# EasyEDA Pro project ProProject_OV-Tracker_V1.0_2024-05-14.epro

# Schematic Schematic1
Create Date: 2024-03-17; Page Name: P1; Project Name: OV-Tracker_V1.0; Schematic Name: Schematic1; Update Date: 2024-03-31; Company: 嘉立创EDA; Page Size: A4; Version: V1.0
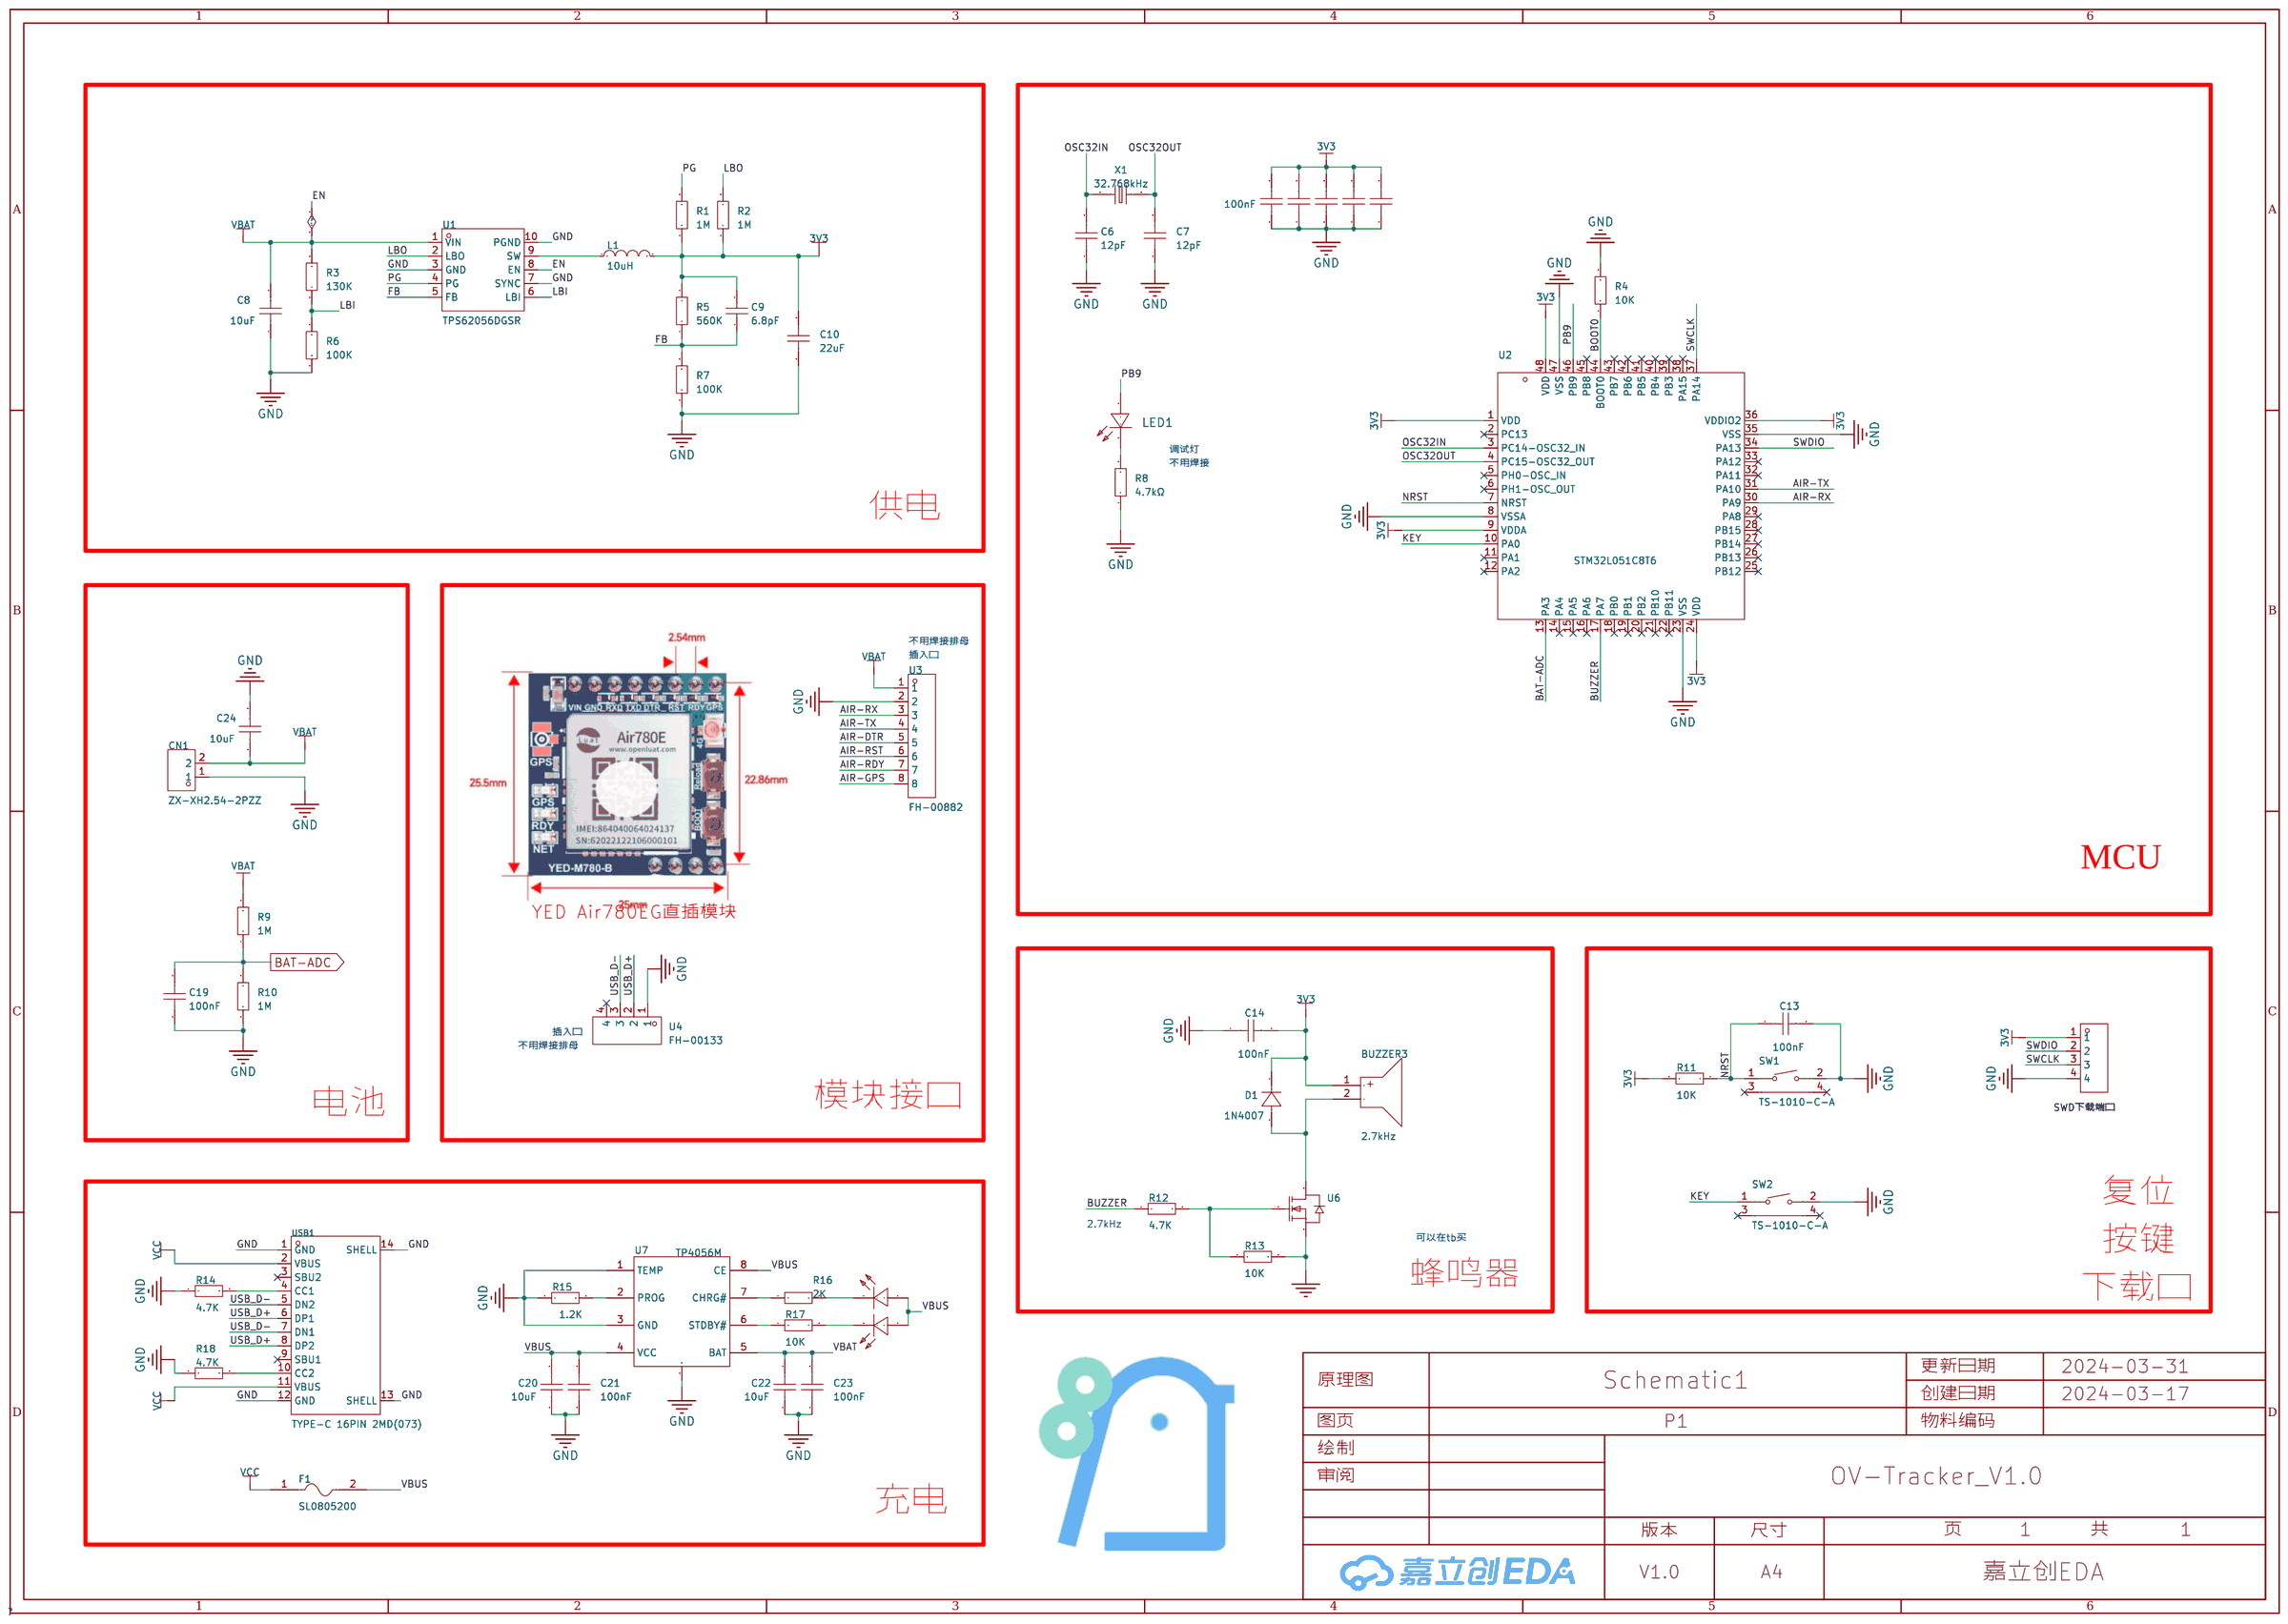
[diagram p0: schematic sheet]

## Parts
BUZZER3  2.7kHz  [BUZ-TH_BD9.0-P4.00-D0.6-FD]
C1  100nF  [C0603]
C2  100nF  [C0603]
C3  100nF  [C0603]
C4  100nF  [C0603]
C5  100nF  [C0603]
C6  12pF  [C0603]
C7  12pF  [C0603]
C8  10uF  [C0805]
C9  6.8pF  [C0603]
C10  22uF  [C0805]
C13  100nF  [C0603]
C14  100nF  [C0603]
C19  100nF  [C0603]
C20  10uF  [C0603]
C21  100nF  [C0603]
C22  10uF  [C0603]
C23  100nF  [C0603]
C24  10uF  [C0805]
CN1  ZX-XH2.54-2PZZ  [CONN-TH_2P-P2.50_HX25003-2A]
D1  1N4007  [SOD-123FL_L2.8-W1.8-LS3.7-RD]
F1  SL0805200  [F0805]
H2  PZ254R-11-04P  [HDR-TH_4P-P2.54-H-M-W10.4]
L1  10uH  [IND-SMD_L3.0-W3.0_FNR30XXS]
LED1  NCD0805B2  [LED0805-R-RD]
LED2  SZYY0805R  [LED0805-R-RD]
LED4  SZYY0805G  [LED0805-R-RD]
R1  1M  [R0603]
R2  1M  [R0603]
R3  130K  [R0603]
R4  10K  [R0603]
R5  560K  [R0603]
R6  100K  [R0603]
R7  100K  [R0603]
R8  4.7kΩ  [R0603]
R9  1M  [R0603]
R10  1M  [R0603]
R11  10K  [R0603]
R12  4.7K  [R0603]
R13  10K  [R0603]
R14  4.7K  [R0603]
R15  1.2K  [R0603]
R16  2K  [R0603]
R17  10K  [R0603]
R18  4.7K  [R0603]
SW1  TS-1010-C-A  [KEY-SMD_TX-1010-X-X]
SW2  TS-1010-C-A  [KEY-SMD_TX-1010-X-X]
U1  TPS62056DGSR  [VSSOP-10_L3.0-W3.0-P0.50-LS4.9-BL]
U2  STM32L051C8T6  [LQFP-48_L7.0-W7.0-P0.50-LS9.0-BL]
U3  FH-00882  [HDR-TH_8P-P2.54-V-F]
U4  FH-00133  [HDR-TH_4P-P2.54-V-F]
U6  2N7002  [SOT-23-3_L2.9-W1.3-P1.90-LS2.4-BR]
U7  TP4056M  [MSOP-8_L3.0-W3.0-P0.65-LS5.0-BL-EP]
USB1  TYPE-C 16PIN 2MD(073)  [USB-C-SMD_TYPE-C-6PIN-2MD-073]
X1  32.768kHz  [OSC-SMD_L3.2-W1.5]

## Library data of the parts
BUZZER3 = FS9042-03: 驱动方式:无源(外部驱动);构造类型:电磁式;频率:2.7kHz;声压(SPL):80dB@3V,10cm;; LCSC Part Name: 电压3V 频率2700Hz 阻抗16Ω; Supplier Part: C482347; Manufacturer: FUET(福声科技); Supplier Footprint: 插件,D=9mm; JLCPCB Part Class: 扩展库; Datasheet: https://atta.szlcsc.com/upload/public/pdf/source/20200113/C482347_CFAB29E7F23AD0BCE8D9A08A7EB3E8CC.pdf; Supplier: LCSC; Oscillator Circuit: 无源(外部驱动); Technology Type: 电磁式; Operating Voltage: 2V~4V; Sound Pressure Level (SPL): 80dB@3V,10cm; Diameter (φD): 9mm; Height: 4.4mm
C1-C5 = CC0603KRX7R8BB104: 容值:100nF;精度:±10%;额定电压:25V;材质(温度系数):X7R;; LCSC Part Name: 100nF ±10% 25V; Supplier Part: C92490; Manufacturer: YAGEO(国巨); Supplier Footprint: 0603; JLCPCB Part Class: Extended Part; Datasheet: https://atta.szlcsc.com/upload/public/pdf/source/20170105/1483610795587.pdf; Supplier: LCSC; Tolerance: ±10%; Voltage Rated: 25V; Temperature Coefficient: X7R
C6 C7 = CL10C120JB8NNNC: 容值:12pF;精度:±5%;额定电压:50V;材质(温度系数):C0G;; LCSC Part Name: 12pF ±5% 50V; Supplier Part: C38523; Manufacturer: SAMSUNG(三星); Supplier Footprint: 0603; JLCPCB Part Class: Basic Part; Datasheet: https://atta.szlcsc.com/upload/public/pdf/source/20160218/1457707763339.pdf; Supplier: LCSC; Tolerance: ±5%; Voltage Rated: 50V; Temperature Coefficient: C0G
C8 C24 = CL21A106KAYNNNE_C15850: 容值:10uF;精度:±10%;额定电压:25V;材质(温度系数):X5R;; LCSC Part Name: 10uF ±10% 25V; Supplier Part: C15850; Manufacturer: SAMSUNG(三星); Manufacturer Part: CL21A106KAYNNNE; Supplier Footprint: 0805; JLCPCB Part Class: 基础库; Datasheet: https://atta.szlcsc.com/upload/public/pdf/source/20160218/1457707763339.pdf; Supplier: LCSC; Tolerance: ±10%; Voltage Rated: 25V; Temperature Coefficient: X5R
C9 = 0603CG6R8C500NT: 容值:6.8pF;额定电压:50V;材质(温度系数):C0G;; LCSC Part Name: 6.8pF 50V; Supplier Part: C1679; Manufacturer: FH(风华); Supplier Footprint: 0603; JLCPCB Part Class: 扩展库; Datasheet: https://atta.szlcsc.com/upload/public/pdf/source/20200305/C486355_26A10D38EF8C2A5C37091D0039909270.pdf; Supplier: LCSC; Voltage Rated: 50V; Temperature Coefficient: C0G
C10 = CL21A226MAQNNNE: 容值:22uF;精度:±20%;额定电压:25V;材质(温度系数):X5R;; LCSC Part Name: 22uF ±20% 25V; Supplier Part: C45783; Manufacturer: SAMSUNG(三星); Supplier Footprint: 0805; JLCPCB Part Class: 基础库; Datasheet: https://atta.szlcsc.com/upload/public/pdf/source/20160218/1457707763339.pdf; Supplier: LCSC; Tolerance: ±20%; Voltage Rated: 25V; Temperature Coefficient: X5R
C13 C14 C19-C23 = CAP_0603: Supplier Footprint: 0603
CN1 = ZX-XH2.54-2PZZ: 插针结构:1x2P;间距:2.54mm;安装方式:直插;参考系列:XH;总PIN数:2P;排数:1;每排PIN数:2;行距:-;额定电流:3A;触头材质:黄铜;触头镀层:锡;工作温度范围:-25℃~+85℃;; Supplier Part: C7429632; Manufacturer: Megastar(兆星); Supplier Footprint: 插件,P=2.54mm; JLCPCB Part Class: 扩展库; Datasheet: https://atta.szlcsc.com/upload/public/pdf/source/20230619/19BA6947230AA44A04D3EDD65E618FD0.pdf; Supplier: LCSC; Pins Structure: 1x2P; Pitch: 2.54mm; Mounting Style: 直插; Reference Series: XH; Number of Pins: 2P; Number of Rows: 1; Number of PINs Per Row: 2; Current Rating (Max): 3A; Contact Material: 黄铜; Contact Plating: 锡; Operating Temperature Range: -25℃~+85℃
D1 = 1N4007_C2892681: 二极管配置:-;正向压降(Vf):1.1V@1A;直流反向耐压(Vr):1kV;平均整流电流(Io):900mA;; LCSC Part Name: 电压:1kV 电流:900mA; Supplier Part: C2892681; Manufacturer: YONGYUTAI(永裕泰); Supplier Footprint: SOD-123FL; JLCPCB Part Class: 扩展库; Datasheet: https://atta.szlcsc.com/upload/public/pdf/source/20210906/CD4B8BA5932635E7169B31B2BD14088A.pdf; Supplier: LCSC; Forward Voltage (Vf@If): 1.1V@1A; Reverse Voltage (Vr): 1kV; Average Rectified Current (Io): 900mA; Reverse Leakage Current: 10uA@1kV
F1 = SL0805200: 最大电压:6V;最大电流:50A;保持电流:2A;跳闸电流:4A;; LCSC Part Name: 6V 2A 0805自恢复; Supplier Part: C70158; Manufacturer: 台湾陆海; Supplier Footprint: 0805; JLCPCB Part Class: 扩展库; Datasheet: https://atta.szlcsc.com/upload/public/pdf/source/20160823/1471947504787.pdf; Supplier: LCSC; Operating Voltage (Max): 6V; Current Rating (Max): 50A; Hold Current: 2A; Trip Current: 4A; Power Dissipation: 1W; Resistance - Initial (Ri) (Min): 8mΩ; Resistance - Post Trip (R1) (Max): 55mΩ; Maximum Time to Trip: 5s; Operating Temperature: -40℃~+70℃
H2 = PZ254R-11-04P: 间距:2.54mm;总PIN位数:4;排数:1;插针结构:1x4P;行距:-;安装类型:弯插;圆针/方针:方针;额定电流:-;额定电压:-;配合针长度:6mm;塑高:2.5mm;触头材质:黄铜;触头镀层:-;工作温度范围:-40℃~+105℃;颜色:黑色;; LCSC Part Name: 2.54mm 1x4P 弯插 方针; Supplier Part: C492412; Manufacturer: XFCN(兴飞); Supplier Footprint: 插件,P=2.54mm; JLCPCB Part Class: 扩展库; Supplier: LCSC; Pitch: 2.54mm; Number of Pins: 4; Number of Rows: 1; Pin Structure: 1x4P; Mounting Type: 弯插; Circluar Pins/Square Pins: 方针; Length of Mating Pin: 6mm; Insulation Height: 2.5mm; Contact Material: 黄铜; Operating Temperature Range: -40℃~+105℃; Color: 黑色
L1 = FNR3015S100MT: 电感值:10uH;精度:±20%;额定电流:900mA;饱和电流(Isat):920mA;; LCSC Part Name: 10uH ±20% 920mA; Supplier Part: C167757; Manufacturer: cjiang(长江微电); Supplier Footprint: SMD,3x3mm; JLCPCB Part Class: 扩展库; Datasheet: https://atta.szlcsc.com/upload/public/pdf/source/20190327/C167925_9EFF0AABC4CA629C2CC95961DBF7D39D.pdf; Supplier: LCSC; Tolerance: ±20%; Rated Current: 900mA; Saturation Current (Isat): 920mA; DC Resistance (DCR): 325mΩ
LED1 = NCD0805B2: 发光颜色:蓝灯;; LCSC Part Name: 蓝灯 0805蓝灯   正贴; Supplier Part: C84259; Manufacturer: 国星光电; Supplier Footprint: 0805; JLCPCB Part Class: 扩展库; Datasheet: https://atta.szlcsc.com/upload/public/pdf/source/20200820/C84259_E5AC6865415989C4C2C2831134BA3A23.pdf; Supplier: LCSC; Emitted Color: 蓝灯
LED2 = SZYY0805R: 发光颜色:红灯;二极管配置:-;透镜颜色:无色透明;主波长:615nm~630nm;峰值波长:645nm;色温:-;光通量(25时):-;测试电流:10mA;正向电压(VF):2.4V;发光强度:120mcd;功率:40mW;发光角度:120°;安装方式:-;工作温度:-40~+85;; LCSC Part Name: 红灯; Supplier Part: C434431; Manufacturer: yongyu(永裕光电); Supplier Footprint: 0805; JLCPCB Part Class: ExtendedPart; Datasheet: https://atta.szlcsc.com/upload/public/pdf/source/20191204/C434431_431C171B758FE4C37FA40B1B295AA7AB.pdf; Supplier: LCSC; Emitted Color: 红灯; Lens Color: 无色透明; Dominant Wavelength: 615nm~630nm; Peak Wavelength: 645nm; Forward Current: 10mA; Forward Voltage (VF): 2.4V; Luminous Intensity: 120mcd; Power Dissipation: 40mW; Viewing Angle: 120°; Operating Temperature: -40~+85
LED4 = SZYY0805G: 发光颜色:翠绿色;; LCSC Part Name: 翠绿; Supplier Part: C434432; Manufacturer: yongyu(永裕光电); Supplier Footprint: 0805; JLCPCB Part Class: 扩展库; Datasheet: https://atta.szlcsc.com/upload/public/pdf/source/20191204/C434432_9975307E99FEDF79FC6902370AFE95E6.pdf; Supplier: LCSC; Emitted Color: 翠绿色
R1-R7 R9-R18 = Res_0603: Supplier Footprint: 0603
R8 = 0603WAJ0472T5E: 电阻类型:厚膜电阻;阻值:4.7kΩ;精度:±5%;功率:100mW;温度系数:±100ppm/℃;; LCSC Part Name: 厚膜电阻 4.7kΩ ±5% 100mW; Supplier Part: C25999; Manufacturer: UNI-ROYAL(厚声); Supplier Footprint: 0603; JLCPCB Part Class: Extended Part; Datasheet: https://atta.szlcsc.com/upload/public/pdf/source/20200306/C422600_1E6D84923E4A46A82E41ADD87F860B5C.pdf; Supplier: LCSC; Type: 厚膜电阻; Tolerance: ±5%; Power(Watts): 100mW; Temperature Coefficient: ±100ppm/℃; Overload Voltage (Max): 75V; Operating Temperature Range: -55℃~+155℃
SW1 SW2 = TS-1010-C-A: 电路结构:单刀单掷;按钮形状:矩形按钮;作用力:260gf;安装方式:卧贴;开关长度:2.3mm;开关宽度:4.7mm;开关高度:3.5mm;带支架:不带;触点电流:50mA;额定电压(AC):-;额定电压(DC):12V;额定功率:-;绝缘电阻:-;带灯:无;机械寿命:10万次;; LCSC Part Name: 2.3*4.7*3.5mm 卧贴 轻触开关; Supplier Part: C692458; Manufacturer: XKB Connectivity(中国星坤); Supplier Footprint: SMD; JLCPCB Part Class: 扩展库; Datasheet: https://atta.szlcsc.com/upload/public/pdf/source/20211011/09621D275CE0F472C941775DFBBCCC96.pdf; Supplier: LCSC; Circuit: 单刀单掷; Actuator Style: 矩形按钮; Operating Force: 260gf; Mounting Style: 卧贴; Switch Length: 2.3mm; Switch Width: 4.7mm; Switch Height: 3.5mm; Strike Gundam: 不带; Contact Current: 50mA; Voltage Rating (DC): 12V; Actuator/Cap Color: 黑色; With Lamp: 无; Mechanical Life: 10万次; Operating Temperature: -30℃~+85℃
U1 = TPS62056DGSR: 功能类型:降压型;输出类型:固定;输入电压:2.7V~10V;输出电压:3.3V;输出电流(最大值):800mA;; Supplier Part: C182547; Manufacturer: TI(德州仪器); Supplier Footprint: VSSOP-10-0.5mm; JLCPCB Part Class: 扩展库; Datasheet: https://www.ti.com/cn/lit/gpn/tps62056; Supplier: LCSC; Function: 降压型; Output Type: 固定; Input Voltage: 2.7V~10V; Output Voltage: 3.3V; Output Current (Max): 800mA; Switching Frequency: 850kHz; Operating Temperature: -40℃~+125℃@(TJ); Synchronous Rectification: 是; Number of Outputs: 1; Topology: 降压式; Switch tube (built-in/external): 内置
U2 = STM32L051C8T6: CPU内核:ARM-M系列;程序存储容量:64KB;RAM总容量:8KB;GPIO端口数量:37;工作电压范围:1.65V~3.6V;CPU最大主频:32MHz;程序存储器类型:FLASH;; Supplier Part: C110878; Manufacturer: ST(意法半导体); Supplier Footprint: LQFP-48(7x7); JLCPCB Part Class: 扩展库; Datasheet: https://atta.szlcsc.com/upload/public/pdf/source/20170810/C124724_1502335304342879861.pdf; Supplier: LCSC; CPU Core: ARM-M系列; Program Storage Size: 64KB; RAM Size: 8KB; GPIO Ports Number: 37; Operating Voltage Range: 1.65V~3.6V; CPU Maximum Speed: 32MHz; Program Memory Type: FLASH; Operating Temperature Range: -40℃~+85℃; ADC (Bit): 12bit; Peripheral/Function: DMA；PWM; Watchdog: 有; Infrared Data Association: 有; Low-Voltage Detect: 有; Direct Memory Access: 有; Internal Oscillator: 有
U3 = FH-00882: 插孔结构:1x8P;间距:2.54mm;行距:-;圆孔/方孔:方孔;安装类型:直插;排数:单排;总孔位数:8P;额定电流:3A;额定电压:-;插孔方向:顶部;塑高:8.5mm;工作温度范围:-40℃~+105℃;; LCSC Part Name: 间距:2.54mm 1x8P 直插; Supplier Part: C2685213; Manufacturer: Liansheng(连盛); Supplier Footprint: 插件,P=2.54mm; JLCPCB Part Class: 扩展库; Datasheet: https://atta.szlcsc.com/upload/public/pdf/source/20210126/C2685213_DEDF4F94A252AD3036DFB49DBA5648CA.pdf; Supplier: LCSC; Holes Structure: 1x8P; Pitch: 2.54mm; Circular Hole / Square Hole: 方孔; Mounting Type: 直插; Number of Rows: 单排; Number of Holes: 8P; Current Rating (Max): 3A; Holes Direction: 顶部; Insulation Height: 8.5mm; Operating Temperature Range: -40℃~+105℃
U4 = FH-00133: 插孔结构:1x4P;间距:2.54mm;行距:-;圆孔/方孔:方孔;安装类型:直插;排数:单排;总孔位数:4P;额定电流:3A;额定电压:-;插孔方向:顶部;塑高:8.5mm;工作温度范围:-40℃~+105℃;; LCSC Part Name: 间距:2.54mm 1x4P 直插; Supplier Part: C2685089; Manufacturer: Liansheng(连盛); Supplier Footprint: 插件,P=2.54mm; JLCPCB Part Class: 扩展库; Datasheet: https://atta.szlcsc.com/upload/public/pdf/source/20210125/C2685089_4757F012FCD25FE84A67F7C6A4FF34AB.pdf; Supplier: LCSC; Holes Structure: 1x4P; Pitch: 2.54mm; Circular Hole / Square Hole: 方孔; Mounting Type: 直插; Number of Rows: 单排; Number of Holes: 4P; Current Rating (Max): 3A; Holes Direction: 顶部; Insulation Height: 8.5mm; Operating Temperature Range: -40℃~+105℃
U6 = 2N7002: 类型:-;漏源电压(Vdss):-;连续漏极电流(Id):-;功率(Pd):-;导通电阻(RDS(on)@Vgs,Id):-;阈值电压(Vgs(th)@Id):-;栅极电荷(Qg@Vgs):-;输入电容(Ciss@Vds):-;反向传输电容(Crss@Vds):-;; Supplier Part: C727149; Manufacturer: TWGMC(台湾迪嘉); Supplier Footprint: SOT-23; JLCPCB Part Class: ExtendedPart; Datasheet: https://atta.szlcsc.com/upload/public/pdf/source/20200827/C727149_F88DE2A79720D5B1ACE833184507B038.pdf; Supplier: LCSC
U7 = TP4056M: 充电电池的类型:-;电池单元组数:-;最大充电电流:-;充满的电池组电压:-;最大供应电压:-;; Supplier Part: C21417; Manufacturer: TOPPOWER(南京拓微); Supplier Footprint: MSOP-8PP; JLCPCB Part Class: 扩展库; Datasheet: https://atta.szlcsc.com/upload/public/pdf/source/20160713/1468379850451.pdf; Supplier: LCSC
USB1 = TYPE-C 16PIN 2MD(073): 连接器类型:Type-C;标准:-;公母:母座;触点数量:16;端口数量:1;安装方式:卧贴;额定电流 - 电源:5A;工作温度范围:-25℃~+85℃;; LCSC Part Name: TYPE-C母座 16P 4脚插件带定位柱 不锈钢外壳 2次模顶; Supplier Part: C2765186; Manufacturer: SHOU HAN(首韩); Supplier Footprint: SMD; JLCPCB Part Class: 扩展库; Supplier: LCSC; Connector Type: Type-C; Gender: 母座; Number of Contacts: 16; Number of Ports: 1; Mounting Style: 卧贴; Current Rating - Power (Max): 5A; Operating Temperature Range: -25℃~+85℃
X1 = X321532768KGD2SI: 频率:32.768kHz;频率公差:±20ppm;负载电容:12.5pF;; LCSC Part Name: 32.768kHz ±20ppm 12.5pF YST310S; Supplier Part: C620155; Manufacturer: YXC(扬兴晶振); Supplier Footprint: SMD3215-2P; JLCPCB Part Class: Extended Part; Datasheet: https://atta.szlcsc.com/upload/public/pdf/source/20210329/C620155_E5A74FC0D27C5E9015A8D75DE9484FEA.pdf; Supplier: LCSC; Crystal Type: 贴片无源晶振; Frequency Tolerance: ±20ppm; Load Capacitance: 12.5pF; Operating Temperature: -40℃~+85℃

## Nets
3V3: BUZZER3.1(+) C1.2 C2.2 C3.2 C4.2 C5.2 C9.2 C10.2 C14.2 D1.1(K) H2.1 L1.2 R1.1 R2.1 R5.2 R11.2 U2.1(VDD) U2.9(VDDA) U2.24(VDD) U2.36(VDDIO2) U2.48(VDD)
GND: C1.1 C2.1 C3.1 C4.1 C5.1 C6.1 C7.1 C8.1 C10.1 C13.2 C14.1 C19.1 C20.1 C21.1 C22.1 C23.1 C24.2 CN1.1 H2.4 R4.2 R6.1 R7.1 R8.1 R10.1 R13.2 R14.1 R15.1 R18.1 SW1.2 SW2.2 U1.3(GND) U1.7(SYNC) U1.10(PGND) U2.8(VSSA) U2.23(VSS) U2.35(VSS) U2.47(VSS) U3.2 U4.1 U6.2(S) U7.1(TEMP) U7.3(GND) U7.9 USB1.1(GND) USB1.12(GND) USB1.13(SHELL) USB1.14(SHELL)
VBAT: C8.2 C22.2 C23.2 C24.1 CN1.2 R3.2 R9.2 U1.1(VIN) U1.8(EN) U3.1 U7.5(BAT)
VBUS: C20.2 C21.2 F1.2 LED2.1(+) LED4.1(+) U7.4(VCC) U7.8(CE)
VCC: F1.1 USB1.2(VBUS) USB1.11(VBUS)
AIR-DTR: U3.5
AIR-GPS: U3.8
AIR-RDY: U3.7
AIR-RST: U3.6
AIR-RX: U2.30(PA9) U3.3
AIR-TX: U2.31(PA10) U3.4
BAT-ADC: C19.2 R9.1 R10.2 U2.13(PA3)
BOOT0: R4.1 U2.44(BOOT0)
BUZZER: R12.1 U2.17(PA7)
FB: C9.1 R5.1 R7.2 U1.5(FB)
KEY: SW2.1 U2.10(PA0)
LBI: R3.1 R6.2 U1.6(LBI)
LBO: R2.2 U1.2(LBO)
NRST: C13.1 R11.1 SW1.1 U2.7(NRST)
OSC32IN: C6.2 U2.3(PC14-OSC32_IN) X1.1
OSC32OUT: C7.2 U2.4(PC15-OSC32_OUT) X1.2
PB9: LED1.1(+) U2.46(PB9)
PG: R1.2 U1.4(PG)
SWCLK: H2.3 U2.37(PA14)
SWDIO: H2.2 U2.34(PA13)
USB_D+: U4.2 USB1.6(DP1) USB1.8(DP2)
USB_D-: U4.3 USB1.5(DN2) USB1.7(DN1)
$1N718: L1.1 U1.9(SW)
$1N2412: R18.2 USB1.10(CC2)
$1N2414: R14.2 USB1.4(CC1)
$1N2840: R15.2 U7.2(PROG)
$1N2850: R16.1 U7.7(CHRG#)
$1N2851: R17.1 U7.6(STDBY#)
$1N5069: R12.2 R13.1 U6.1(G)
$1N11775: LED1.2(-) R8.2
$1N14587: BUZZER3.2(-) D1.2(A) U6.3(D)
Net-(LED2-2): LED2.2(-) R16.2
Net-(LED4-2): LED4.2(-) R17.2

Not connected (* = marked no-connect by the designer): SW1 3* 4*; SW2 3* 4*; U2 2(PC13)* 5(PH0-OSC_IN)* 6(PH1-OSC_OUT)* 11(PA1)* 12(PA2)* 14(PA4)* 15(PA5)* 16(PA6)* 18(PB0)* 19(PB1)* 20(PB2)* 21(PB10)* 22(PB11)* 25(PB12)* 26(PB13)* 27(PB14)* 28(PB15)* 29(PA8)* 32(PA11)* 33(PA12)* 38(PA15)* 39(PB3)* 40(PB4)* 41(PB5)* 42(PB6)* 43(PB7)* 45(PB8)*; U4 4*; USB1 3(SBU2)* 9(SBU1)*

## Notes on the sheet
- 不用焊接
- 调试灯
- 供电
- 不用焊接排母
- 插入口
- MCU
- YED Air780EG直插模块
- 不用焊接排母
- 插入口
- 模块接口
- SWD下载端口
- 电池
- 复位
- 2.7kHz
- 可以在tb买
- 按键
- 蜂鸣器
- 下载口
- 充电

# Board PCB1
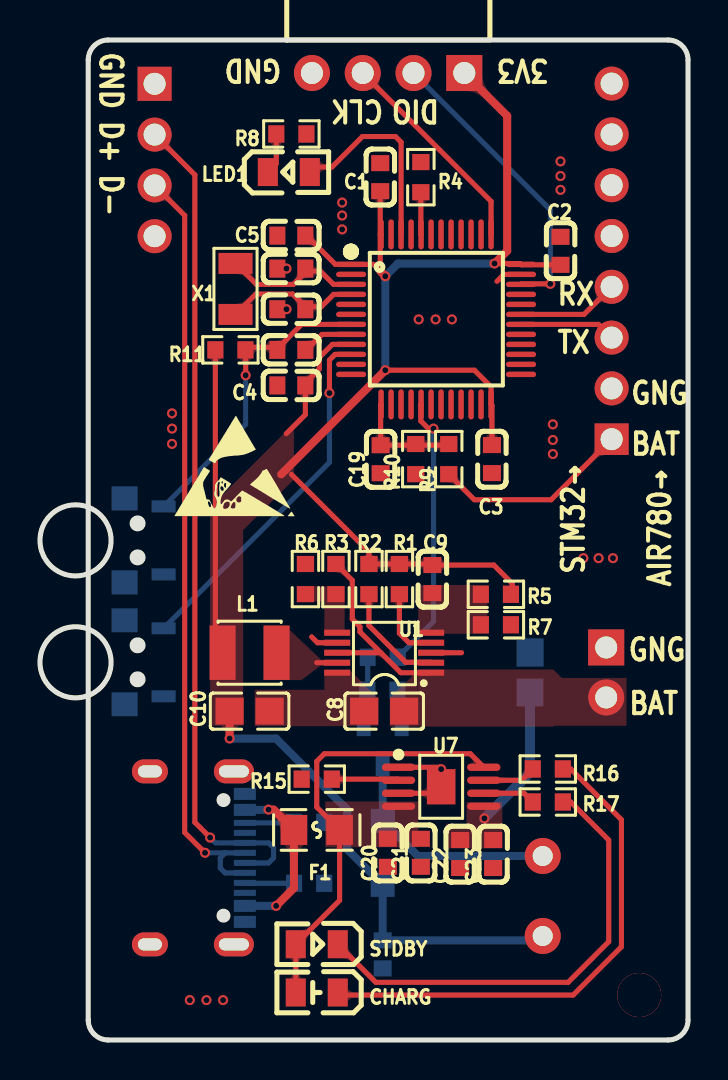
[diagram p1: board, top side]
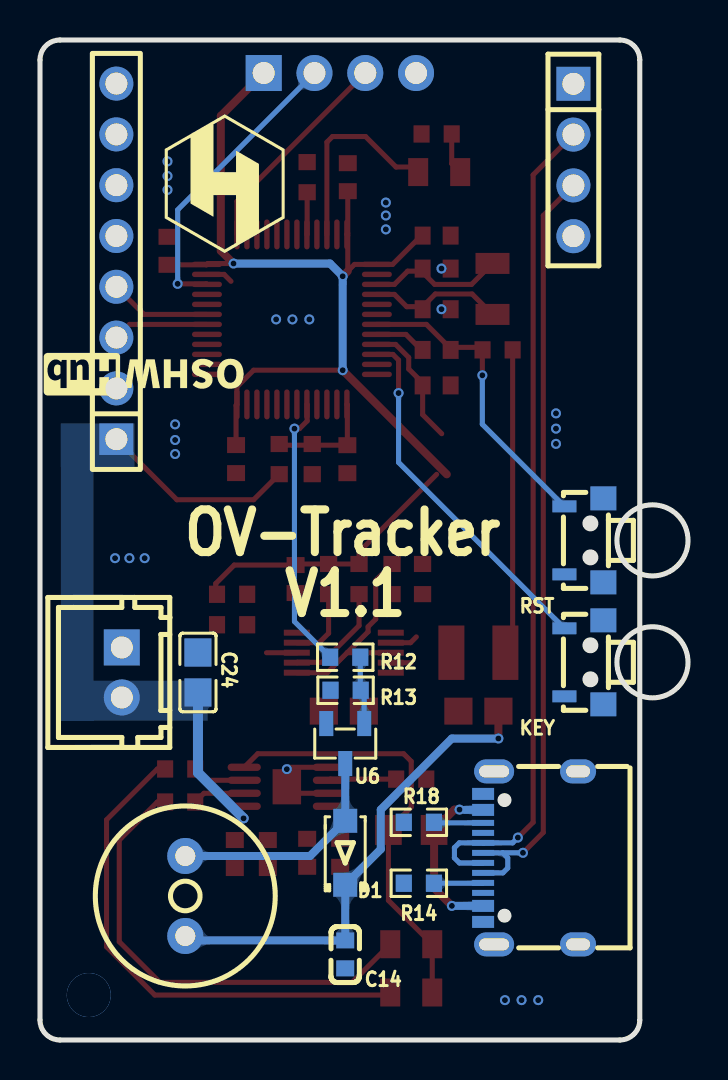
[diagram p2: board, bottom side, seen from below]

Outline 32.41 x 50 mm; copper layers: Top Layer, Bottom Layer. Coordinates in mm from the lower left corner of the outline.
Outline path: circle c1.78,24.98 r1.78 ; circle c1.78,18.89 r1.78 ; 2.41,49 2.41,1 arc(2.71,0.29) 3.41,0 31.41,0 arc(32.12,0.29) 32.41,1 32.41,49 arc(32.12,49.71) 31.41,50 3.41,50 arc(2.71,49.71) 2.41,49
Stack: Top Layer 0.035mm / Dielectric1 1.51mm FR4 er 4.5 / Bottom Layer 0.035mm

## Design rules (mm)
template: JLCPCB Capability(Two Layers Board)
spacing copperThickness1oz (default): track to track 0.102, other pairs 0.152 to 0.3
spacing copperThickness2oz: track to track 0.203, other pairs 0.152 to 0.3
track width copperThickness1oz (default): min 0.127, default 0.254, max 2.54
track width copperThickness2oz: min 0.203, default 0.254, max 2.54
differential pair differentialPair (default): width min 0.127, default 0.254, max 2.54; gap min 0.152, default 0.152
via viaSize (default): diameter min 0.5, default 0.61, max 10; hole min 0.3, default 0.305, max 6.3

## Placement (name value [footprint] x y rotation side)
BUZZER3  2.7kHz  [BUZ-TH_BD9.0-P4.00-D0.6-FD]  25.15 7.2 90 bottom
C1  100nF  [C0603]  17.02 43.14 270 top
C2  100nF  [C0603]  26.03 39.46 270 top
C3  100nF  [C0603]  22.61 29.05 90 top
C4  100nF  [C0603]  12.57 32.73 0 top
C5  100nF  [C0603]  12.57 40.22 0 top
C6  12pF  [C0603]  12.57 38.57 0 top
C7  12pF  [C0603]  12.57 36.54 0 top
C8  10uF  [C0805]  17.22 16.44 0 top
C9  6.8pF  [C0603]  19.63 23.05 90 top
C10  22uF  [C0805]  10.48 16.44 180 top
C13  100nF  [C0603]  12.57 34.51 0 top
C14  100nF  [C0603]  17.14 4.28 90 bottom
C19  100nF  [C0603]  17.04 29.04 90 top
C20  10uF  [C0603]  17.4 9.36 90 top
C21  100nF  [C0603]  19.05 9.36 90 top
C22  10uF  [C0603]  21.02 9.3 90 top
C23  100nF  [C0603]  22.67 9.3 90 top
C24  10uF  [C0805]  24.51 18.38 90 bottom
CHARG  SZYY0805R  [LED0805-R-RD]  13.84 2.38 180 top
CN1  ZX-XH2.54-2PZZ  [CONN-TH_2P-P2.50_HX25003-2A]  28.32 18.38 270 bottom
D1  1N4007  [SOD-123FL_L2.8-W1.8-LS3.7-RD]  17.14 9.36 90 bottom
F1  SL0805200  [F0805]  13.84 10.5 0 top
H2  PZ254R-11-04P  [HDR-TH_4P-P2.54-H-M-W10.4]  17.41 48.35 180 top
KEY  TS-1010-C-A  [KEY-SMD_TX-1010-X-X]  5.21 18.89 270 bottom
L1  10uH  [IND-SMD_L3.0-W3.0_FNR30XXS]  10.48 19.36 0 top
LED1  NCD0805B2  [LED0805-R-RD]  12.45 43.4 0 top
R1  1M  [R0603]  17.98 23.05 270 top
R2  1M  [R0603]  16.45 23.05 270 top
R3  130K  [R0603]  14.8 23.05 90 top
R4  10K  [R0603]  19.05 43.14 90 top
R5  560K  [R0603]  22.8 22.28 0 top
R6  100K  [R0603]  13.28 23.05 270 top
R7  100K  [R0603]  22.8 20.76 180 top
R8  4.7kΩ  [R0603]  12.57 45.3 180 top
R9  1M  [R0603]  20.45 29.05 270 top
R10  1M  [R0603]  18.8 29.05 90 top
R11  10K  [R0603]  9.52 34.51 180 top
R12  4.7K  [R0603]  17.14 19.14 180 bottom
R13  10K  [R0603]  17.13 17.49 0 bottom
R14  4.7K  [R0603]  13.46 7.84 180 bottom
R15  1.2K  [R0603]  13.84 13.04 0 top
R16  2K  [R0603]  25.4 13.55 0 top
R17  10K  [R0603]  25.4 11.9 0 top
R18  4.7K  [R0603]  13.46 10.88 180 bottom
RST  TS-1010-C-A  [KEY-SMD_TX-1010-X-X]  5.21 24.98 270 bottom
STDBY  SZYY0805G  [LED0805-R-RD]  13.84 4.79 180 top
U1  TPS62056DGSR  [VSSOP-10_L3.0-W3.0-P0.50-LS4.9-BL]  17.22 19.36 90 top
U2  STM32L051C8T6  [LQFP-48_L7.0-W7.0-P0.50-LS9.0-BL]  19.81 36.03 270 top
U3  FH-00882  [HDR-TH_8P-P2.54-V-F]  28.59 38.93 90 bottom
U4  FH-00133  [HDR-TH_4P-P2.54-V-F]  5.73 44 270 bottom
U6  2N7002  [SOT-23-3_L2.9-W1.3-P1.90-LS2.4-BR]  17.14 14.82 90 bottom
U7  TP4056M  [MSOP-8_L3.0-W3.0-P0.65-LS5.0-BL-EP]  20.07 12.66 270 top
USB1  TYPE-C 16PIN 2MD(073)  [USB-C-SMD_TYPE-C-6PIN-2MD-073]  7.87 9.11 90 bottom
X1  32.768kHz  [OSC-SMD_L3.2-W1.5]  9.78 37.55 270 top

## Footprints (pads in the part's own frame, mm; a bottom-side part is the same pattern mirrored in y, then rotated)
BUZ-TH_BD9.0-P4.00-D0.6-FD
  round 1.8 hole 1: 1(-2,0) 2(2,0)
C0603
  rect 0.8x0.9 smd: 1(-0.7,0) 2(0.7,0)
C0805
  rect 1.41x1.35 smd: 1(-1,0) 2(1,0)
CONN-TH_2P-P2.50_HX25003-2A
  rect 1.8x1.8 hole 1.1: 1(-1.25,0)
  round 1.8 hole 1.1: 2(1.25,0)
F0805
  rect 1.335x1.5 smd: 1(-1.143,0) 2(1.143,0)
HDR-TH_4P-P2.54-H-M-W10.4
  rect 1.8x1.8 hole 1.1: 1(-3.81,0)
  round 1.8 hole 1.1: 2(-1.27,0) 3(1.27,0) 4(3.81,0)
HDR-TH_4P-P2.54-V-F
  rect 1.7x1.7 hole 1.1: 1(-3.81,0)
  round 1.7 hole 1.1: 2(-1.27,0) 3(1.27,0) 4(3.81,0)
HDR-TH_8P-P2.54-V-F
  rect 1.575x1.7 hole 1.1: 1(-8.89,0)
  round 1.7 hole 1.1: 2(-6.35,0) 3(-3.81,0) 4(-1.27,0) 5(1.27,0) 6(3.81,0) 7(6.35,0) 8(8.89,0)
IND-SMD_L3.0-W3.0_FNR30XXS
  rect 1.3x2.72 smd: 1(1.35,0) 2(-1.35,0)
KEY-SMD_TX-1010-X-X
  rect 0.6x1.2 smd: 1(-1.7,-0.975) 2(1.7,-0.975)
  rect 1.2x1.3 smd: 3(-2.1,0.975) 4(2.1,0.975)
LED0805-R-RD
  rect 1x1.399 smd: 1(1.05,0) 2(-1.05,0)
LQFP-48_L7.0-W7.0-P0.50-LS9.0-BL
  oval 0.27x1.5 smd: 1(-2.75,-4.25) 2(-2.25,-4.25) 3(-1.75,-4.25) 4(-1.25,-4.25) 5(-0.75,-4.25) 6(-0.25,-4.25) 7(0.25,-4.25) 8(0.75,-4.25) 9(1.25,-4.25) 10(1.75,-4.25) 11(2.25,-4.25) 12(2.75,-4.25) 25(2.75,4.25) 26(2.25,4.25) 27(1.75,4.25) 28(1.25,4.25) 29(0.75,4.25) 30(0.25,4.25) 31(-0.25,4.25) 32(-0.75,4.25) 33(-1.25,4.25) 34(-1.75,4.25) 35(-2.25,4.25) 36(-2.75,4.25)
  oval 1.5x0.27 smd: 13(4.25,-2.75) 14(4.25,-2.25) 15(4.25,-1.75) 16(4.25,-1.25) 17(4.25,-0.75) 18(4.25,-0.25) 19(4.25,0.25) 20(4.25,0.75) 21(4.25,1.25) 22(4.25,1.75) 23(4.25,2.25) 24(4.25,2.75) 37(-4.25,2.75) 38(-4.25,2.25) 39(-4.25,1.75) 40(-4.25,1.25) 41(-4.25,0.75) 42(-4.25,0.25) 43(-4.25,-0.25) 44(-4.25,-0.75) 45(-4.25,-1.25) 46(-4.25,-1.75) 47(-4.25,-2.25) 48(-4.25,-2.75)
MSOP-8_L3.0-W3.0-P0.65-LS5.0-BL-EP
  oval 0.364x1.662 smd: 1(-0.975,-2.131) 2(-0.325,-2.131) 3(0.325,-2.131) 4(0.975,-2.131) 5(0.975,2.131) 6(0.325,2.131) 7(-0.325,2.131) 8(-0.975,2.131)
  rect 1.76x1.425 smd: 9(0,0)
OSC-SMD_L3.2-W1.5
  rect 1.05x1.7 smd: 1(-1.275,0) 2(1.275,0)
R0603
  rect 0.806x0.864 smd: 1(-0.753,0) 2(0.753,0)
SOD-123FL_L2.8-W1.8-LS3.7-RD
  rect 1.2x1.2 smd: 1(-1.6,0) 2(1.6,0)
SOT-23-3_L2.9-W1.3-P1.90-LS2.4-BR
  rect 1.25x0.7 smd: 1(1,-0.95) 2(1,0.95) 3(-1,0)
USB-C-SMD_TYPE-C-6PIN-2MD-073
  rect 0.6x1.1 smd: 1(-3.2,2.375) 2(-2.4,2.375) 11(2.4,2.375) 12(3.2,2.375)
  rect 0.3x1.1 smd: 3(-1.75,2.375) 4(-1.25,2.375) 5(-0.75,2.375) 6(-0.25,2.375) 7(0.25,2.375) 8(0.75,2.375) 9(1.25,2.375) 10(1.75,2.375)
  oval 1.2x1.8 hole 0.6x1.2: 13(-4.325,-2.375) 14(4.325,-2.375)
  oval 1.2x2 hole 0.6x1.5: 13(-4.325,1.825) 14(4.325,1.825)
VSSOP-10_L3.0-W3.0-P0.50-LS4.9-BL
  rect 0.3x1.3 smd: 1(-1,-2.35) 2(-0.5,-2.35) 3(0,-2.35) 4(0.5,-2.35) 5(1,-2.35) 6(1,2.35) 7(0.5,2.35) 8(0,2.35) 9(-0.5,2.35) 10(-1,2.35)

## Nets
As in the schematic, except:
GND: C1.1 C2.1 C3.1 C4.1 C5.1 C6.1 C7.1 C8.1 C10.1 C13.2 C14.1 C19.1 C20.1 C21.1 C22.1 C23.1 C24.2 CN1.1 H2.4 KEY.2 R4.2 R6.1 R7.1 R8.1 R10.1 R13.2 R14.1 R15.1 R18.1 RST.2 U1.3 U1.7 U1.10 U2.8 U2.23 U2.35 U2.47 U3.2 U4.1 U6.2 U7.1 U7.3 U7.9 USB1.1 USB1.12 USB1.13 USB1.14
VBUS: C20.2 C21.2 CHARG.1 F1.2 STDBY.1 U7.4 U7.8
KEY: KEY.1 U2.10
NRST: C13.1 R11.1 RST.1 U2.7
$1N2846: R17.2 STDBY.2
$1N2849: CHARG.2 R16.2

Pads without a net: KEY 3 4; RST 3 4; U2 2 5 6 11 12 14 15 16 18 19 20 21 22 25 26 27 28 29 32 33 38 39 40 41 42 43 45; U4 4; USB1 3 9

## Via types
v1: diameter 2.2, hole 2.2, Top Layer to Bottom Layer, 1 via
v2: diameter 0.5, hole 0.3, Top Layer to Bottom Layer, 37 vias

## Routing (per net, layer and track width the routed paths; a pad name or vN(x,y) marks a point on that pad's centre or on a via; arc(x,y) is an arc through that point)
3V3: length 109.2
  Top Layer w0.254: C3.2 22.61,31.74 U2.24 22.56,32.66 21.73,33.49 v2(17.27,33.49) ; C1.2 17.02,40.32 U2.48 17.02,40.24 17.02,38.44 16.68,38.78 U2.1 14.78,38.78 13.33,40.22 C5.2 ; 12.32,30.31 13.27,31.27 13.27,32.86 13.97,33.55 13.97,34.12 14.62,34.78 U2.9 ; 12.57,28.28 16.45,24.4 R2.1 R1.1 19.57,23.8 C9.2 22.7,23.75 23.62,22.82 23.62,22.35 R5.2 ; L1.2 8.77,19.73 8.77,34.63 ; C2.2 24.08,38.76 U2.36 24.02,38.82 v2(22.73,38.82)
  Top Layer w0.4: 17.02,38.44 v2(17.27,38.19) ; v2(17.27,33.49) 12.06,28.28 ; C10.2 v2(9.48,15.08) ; H2.1 23.37,46.2 23.37,39.46 v2(22.73,38.82)
  Bottom Layer w0.4: v2(17.27,33.49) v2(17.27,38.19) 17.91,38.82 v2(22.73,38.82) ; v2(9.48,15.08) 11.81,15.08 15.37,11.52 15.37,9.54 D1.1 C14.2 25.15,4.98
GND: length 11.3
  Top Layer w0.254: 13.27,34.63 13.46,34.63 14.11,35.28 U2.8 ; 22.86,37.94 23.2,38.28 U2.35 ; 13.59,20.16 13.88,19.86 U1.7 ; U7.1 19.97,13.64 v2(20.07,13.54) ; U7.3 19.74,12.34 U7.9 ; U1.3 21.08,19.36
  vias: v2(6.6,31.33) v2(6.6,30.57) v2(6.6,29.81) v2(7.49,1.99) v2(8.33,1.99) v2(9.16,1.99) v2(12.33,38.57) v2(12.33,36.54) v2(15.11,41.87) v2(15.11,41.22) v2(15.11,40.53) v2(18.94,36.03) v2(19.79,36.03) v2(20.6,36.03) v2(25.65,30.78) v2(25.65,30) v2(25.65,29.3) v2(26.03,43.93) v2(26.03,43.2) v2(26.03,42.51) v2(27.18,24.09) v2(27.94,24.09) v2(28.66,24.09)
VBAT: length 27.6
  Top Layer w0.254: 17.05,19.36 16,20.41 16,20.66 15.62,21.04 15.62,22.98 R3.2 ; 17.05,19.36 U1.8 ; 17.05,19.36 18.05,18.36 U1.1 ; U3.1 25.57,27.01 21.73,27.01 R9.2
  Bottom Layer w0.5: v2(22.23,11.08) 24.51,13.37 C24.1
VBUS: length 21.6
  Top Layer w0.254: 12.79,2.5 STDBY.1 14.99,6.98 F1.2 13.84,11.65 13.84,13.93 14.22,14.31 21.52,14.31 U7.8
VCC: length 8.3
  Top Layer w0.4: v2(11.43,11.52) 11.68,11.52 F1.1 12.7,7.6 v2(11.81,6.71)
  Bottom Layer w0.4: USB1.11 11.18,11.51 ; USB1.2 v2(11.81,6.71)
(no net):
  vias: v1(29.97,2.25)
AIR-RX: length 4.8
  Top Layer w0.254: U2.30 27.93,35.78 U3.3
AIR-TX: length 5.1
  Top Layer w0.254: U3.4 27.21,36.28 U2.31
BAT-ADC: length 5.5
  Top Layer w0.254: R9.1 20.39,29.74 C19.2 17.04,31.76 U2.13
BOOT0: length 2.1
  Top Layer w0.254: U2.44 19.05,40.29 R4.1
BUZZER: length 13.8
  Top Layer w0.254: v2(19.68,30.57) 19.43,30.57 19.05,30.95 19.05,31.77 U2.17
  Bottom Layer w0.254: v2(19.68,30.57) 19.68,20.93 R12.1
KEY: length 18.1
  Top Layer w0.254: U2.10 14.76,34.28 14.48,34 v2(14.48,32.35)
  Bottom Layer w0.254: 6.18,20.58 14.48,28.88 v2(14.48,32.35)
LBO: length 5.5
  Top Layer w0.254: R2.2 16.45,20.72 18.29,18.89 19.54,18.89 U1.2
NRST: length 15.4
  Top Layer w0.254: U2.7 13.08,35.78 11.94,34.63 10.28,34.63 10.29,34.62 v2(10.29,33.24)
  Bottom Layer w0.254: RST.1 10.29,30.79 v2(10.29,33.24)
OSC32IN: length 6.8
  Top Layer w0.254: U2.3 14.68,37.78 14.02,38.44 13.27,38.44 13.27,38.38 12.67,37.78 10.83,37.78 9.78,38.83
OSC32OUT: length 6.7
  Top Layer w0.254: U2.4 14.68,37.28 14.07,36.67 13.27,36.67 12.64,37.3 10.8,37.3 X1.2
PB9: length 10
  Top Layer w0.254: LED1.1 13.75,43.65 14.6,43.65 16.13,45.17 17.78,45.17 18.06,44.89 U2.46
PG: length 3.7
  Top Layer w0.254: R1.2 17.98,20.34 18.45,19.86 U1.4
SWCLK: length 10.7
  Top Layer w0.254: U2.37 22.56,41.93 H2.3
SWDIO: length 14.9
  Top Layer w0.254: v2(25.53,37.81) 24.09,37.81 U2.34
  Bottom Layer w0.254: v2(25.53,37.81) 25.53,41.5 H2.2
USB_D+: length 41.7
  Top Layer w0.254: U4.2 7.75,43.26 7.75,10.88 v2(8.51,10.12)
  Bottom Layer w0.254: v2(8.51,10.12) 8.77,9.86 USB1.8 11.44,9.86 11.68,9.61 11.68,9.11 11.43,8.85 10.25,8.85 USB1.6
USB_D-: length 38.6
  Top Layer w0.254: U4.3 7.24,41.22 7.24,10.38 v2(8.25,9.36)
  Bottom Layer w0.254: 9.27,9.36 9.02,9.11 9.02,8.6 9.26,8.36 USB1.5 ; 9.27,9.36 9.26,9.36 v2(8.25,9.36) ; 9.27,9.36 USB1.7
$1N718: length 1
  Top Layer w0.254: U1.9 13.84,18.86
$1N2412: length 2.5
  Bottom Layer w0.254: R18.2 12.68,10.86 USB1.10
$1N2414: length 2.5
  Bottom Layer w0.254: USB1.4 10.27,7.84 R14.2
$1N2840: length 3.4
  Top Layer w0.254: R15.2 17.88,13.04 U7.2
$1N2846: length 23.3
  Top Layer w0.254: STDBY.2 16.8,2.88 26.42,2.88 28.45,4.92 28.45,10 26.54,11.9 R17.2
$1N2849: length 25.6
  Top Layer w0.254: R16.2 26.54,13.55 29.08,11.01 29.08,4.66 26.67,2.25 15.02,2.25 CHARG.2
$1N2850: length 2.7
  Top Layer w0.254: U7.7 24.08,12.99 R16.1
$1N2851: length 2.6
  Top Layer w0.254: R17.1 24.21,12.34 U7.6
$1N5069: length 3.4
  Bottom Layer w0.254: R12.2 16.39,17.51 16.37,17.49 16.19,17.31 U6.1
$1N11775: length 2.1
  Top Layer w0.254: R8.2 11.82,43.82 LED1.2
$1N14587: length 11.6
  Bottom Layer w0.4: BUZZER3.2 18.9,9.2 D1.2 U6.3

## Copper pours and planes (outline as drawn; the poured copper is in the pictures)
3V3 on Top Layer: 8.51,30.82 12.7,30.82 12.7,20.66 8.51,20.66
3V3 on Top Layer: 8.51,20.79 10.16,20.79 10.16,15.71 8.51,15.71
GND on Top Layer: 14.22,18.5 15.53,18.5 15.53,16.34 14.22,16.34
GND on Top Layer: -6.48,61.68 39.5,61.68 39.5,-6.64 -6.48,-6.64
GND on Top Layer: 15.4,18.48 16.92,18.48 16.92,15.71 15.4,15.71
GND on Top Layer: 10.74,17.51 15.53,17.51 15.53,15.69 10.74,15.69
GND on Bottom Layer: -8,64.61 37.97,64.61 37.97,-3.72 -8,-3.72
VBAT on Top Layer: 21.34,11.9 23.12,11.9 23.12,9.58 21.34,9.58
VBAT on Top Layer: 17.49,18.48 18.89,18.48 18.89,15.67 17.49,15.67
VBAT on Top Layer: 18.89,18.53 25.68,18.53 25.68,15.67 18.89,15.67
VBAT on Top Layer: 20.31,10.82 21.9,10.82 21.9,9.58 20.31,9.58
VBAT on Top Layer: 23.6,18.1 29.34,18.1 29.34,15.71 23.6,15.71
VBAT on Bottom Layer: 29.73,30.82 31.37,30.82 31.37,15.96 29.73,15.96
VBAT on Bottom Layer: 24.02,17.96 31.37,17.96 31.37,15.96 24.02,15.96
VBAT on Bottom Layer: 27.69,30.82 31.37,30.82 31.37,28.66 27.69,28.66
VBUS on Top Layer: 14.26,11.92 18.92,11.92 18.92,9.64 14.26,9.64
FB on Top Layer: 18.92,22.75 22.38,22.75 22.38,20.31 18.92,20.31
LBI on Top Layer: 13.01,22.69 15.24,22.69 15.24,21.93 13.01,21.93
LBI on Top Layer: 14.22,22.64 15.24,22.64 15.24,20.28 14.22,20.28
$1N718 on Top Layer: 11.18,20.66 14.22,20.66 14.22,18 11.18,18

Small or netless copper shapes (teardrops, artwork), in the pictures only: 100 on Top Layer, 37 on Bottom Layer

## Text on the board
Bottom Silkscreen Layer: V1.1 | OV-Tracker
Top Silkscreen Layer: RX | TX | GND | CLK | DIO | 3V3 | D+ | D- | GNG | BAT | STM32→ | AIR780→
